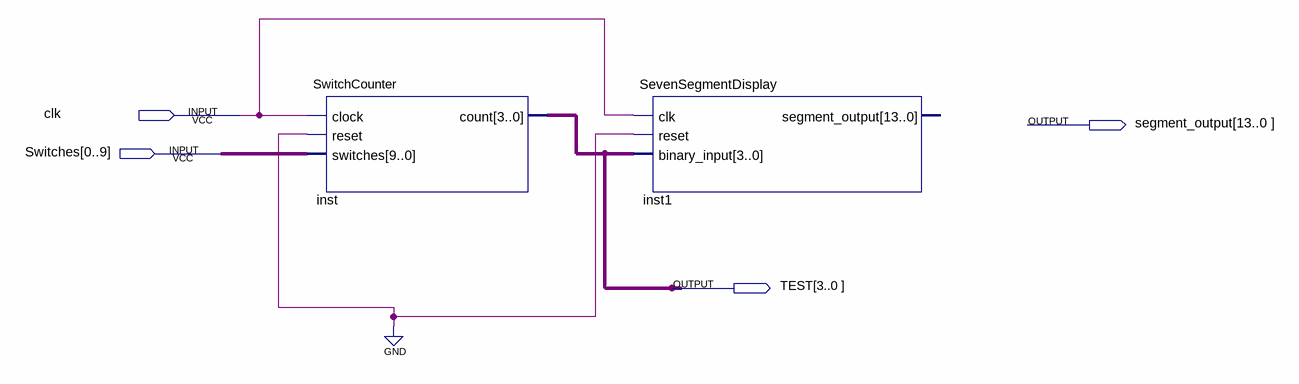
[diagram p0: schematic sheet]
// Quartus schematic Vhdl1.bdf as structural Verilog: 2 symbols, 4 pins
module Vhdl1 (
  input  clk,
  input  [0:9] Switches,
  output [13:0] segment_output,
  output [3:0] TEST
);

  SwitchCounter inst (.clock(clk), .reset(1'b0), .switches(Switches), .count(TEST));
  SevenSegmentDisplay inst1 (.clk(clk), .reset(1'b0), .binary_input(TEST));  // open: segment_output
endmodule
